# Altium schematic sheet POLL.SchDoc
size A4
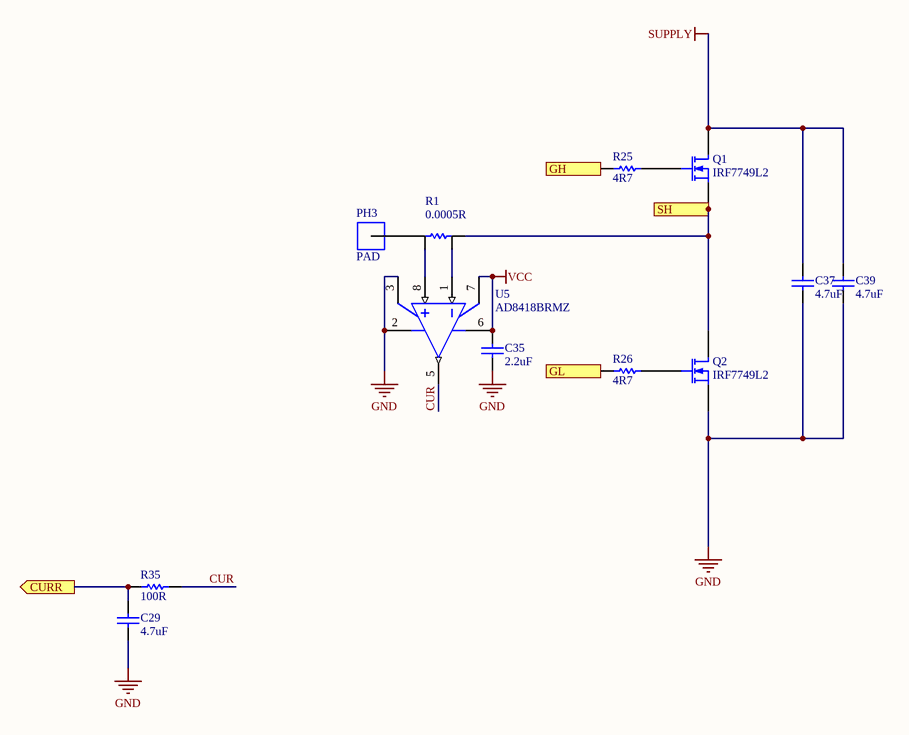
[diagram p0: POLL.SchDoc]

## Parts
C29  value 4.7uF  [C0603[1608X92]]  (hidden comment: 4.7uF 6.3V 0603)
C35  value 2.2uF  [C0603[1608X92]]  (hidden comment: 2.2uF 6.3V 0603)
C37  value 4.7uF  [C1210[3225X200]]  (hidden comment: 4.7uF 100V 1210)
C39  value 4.7uF  [C1210[3225X200]]  (hidden comment: 4.7uF 100V 1210)
PH3  PAD  [PAD]
Q1  IRF7749L2  [DIRECTFET-9]
Q2  IRF7749L2  [DIRECTFET-9]
R1  value 0.0005R  [LRMAP3920B]  (hidden comment: LRMAP3920B)
R25  value 4R7  [R0603[1608]]  (hidden comment: 4R7 1% 0603)
R26  value 4R7  [R0603[1608]]  (hidden comment: 4R7 1% 0603)
R35  value 100R  [R0603[1608]]  (hidden comment: 100R 1% 0603)
U5  AD8418BRMZ  [MSOP-8]

## Ports
CURR (out), GH (in), GL (in), SH

## Nets
GND: C29.1 C35.2 C37.1 C39.1 Q2.2(S) U5.2(GND) U5.3(VREF2)
SUPPLY: C37.2 C39.2 Q1.3(D)
VCC: C35.1 U5.6(VS) U5.7(VREF1)
CUR: R35.2 U5.5(OUT)
CURR: C29.2 R35.1 ; port CURR
GH: R25.1 ; port GH
GL: R26.1 ; port GL
SH: Q1.2(S) Q2.3(D) R1.2 ; port SH
NetPH3_0: PH3.0(PH) R1.1
NetQ1_1: Q1.1(G) R25.2
NetQ2_1: Q2.1(G) R26.2
NetR1_3: R1.3 U5.8(IN+)
NetR1_4: R1.4 U5.1(IN-)

## Library data of the parts
C29 = CAP_4.7uF_6.3V_0603_10%: 4.7uF 6.3V 10% 0603 (1608 Metric); PartNumber: GRM188R60J475KE19D; Manufacturer: Murata; TemperatureCoefficient: X5R; Mounting Technology: Surface Mount; PackageReference: 0603; PackageDescription: 0603 (1608 Metric); Voltage: 6.3V; Tolerance: 10%
C35 = CAP_2.2uF_6.3V_0603_10%: 2.2uF 6.3V 10% 0603 (1608 Metric); PartNumber: GRM185R60J225KE26D; Manufacturer: Murata; TemperatureCoefficient: X5R; Mounting Technology: Surface Mount; PackageReference: 0603; PackageDescription: 0603 (1608 Metric); Voltage: 6.3V; Tolerance: 10%
C37 C39 = CAP_4.7uF_100V_1210_10%: 4.7uF 100V 10% 1210 (3225 Metric); PartNumber: GRJ32DC72A475KE11L; Manufacturer: Murata; Mounting Technology: Surface Mount; PackageReference: 1210; PackageDescription: 1210 (3225 Metric); Voltage: 100V; Tolerance: 10%
Q1 Q2 = IRF7749L2: N-Channel MOSFET; PartNumber: IRF7749L1TRPBF; Manufacturer: Infineon Technologies; PackageReference: DIRECTFET L8; PackageDescription: DirectFET™ Isometric L8; Mounting Technology: Surface Mount
R1 = LRMAP3920B: Current Sense Resistor, 0.0005R; Manufacturer: IRC / TT Electronics; Power: 5W; Tolerance: 1%; PartNumber: LRMAP3920B; PackageReference: 2726; Mounting Technology: Surface Mount
R25 R26 = RES_4R7_0603_1%: 4R7 0.25W 1% 0603 (1005 Metric); Manufacturer: Vishay / Dale; PartNumber: CRCW06034R70JNEAHP; Tolerance: 1%; Power: 0.25W; Mounting Technology: Surface Mount; PackageReference: 0603; PackageDescription: 0603 (1608 Metric); ComponentLink1Description: Datasheet; ComponentLink1URL: http://www.vishay.com/docs/20043/crcwhpe3.pdf
R35 = RES_100R_0603_1%: 100R 0.25W 1% 0603 (1005 Metric); Manufacturer: Vishay / Dale; PartNumber: CRCW0603100RFKEAHP; Tolerance: 1%; Power: 0.25W; Mounting Technology: Surface Mount; PackageReference: 0603; PackageDescription: 0603 (1608 Metric); ComponentLink1Description: Datasheet; ComponentLink1URL: http://www.vishay.com/docs/20043/crcwhpe3.pdf
U5 = AD8418BRMZ: Current Sense Amplifiers Zero Drift ,Precision Current Sense AMP; Manufacturer: Analog Devices; PartNumber: AD8418BRMZ; Mounting Technology: Surface Mount; PackageReference: MSOP-8; PackageDescription: SOP, 8-Leads, Body 3x3mm, Pitch 0.65mm, IPC Medium Density